# Altium project STM32F405RGT6核心板.PrjPcb
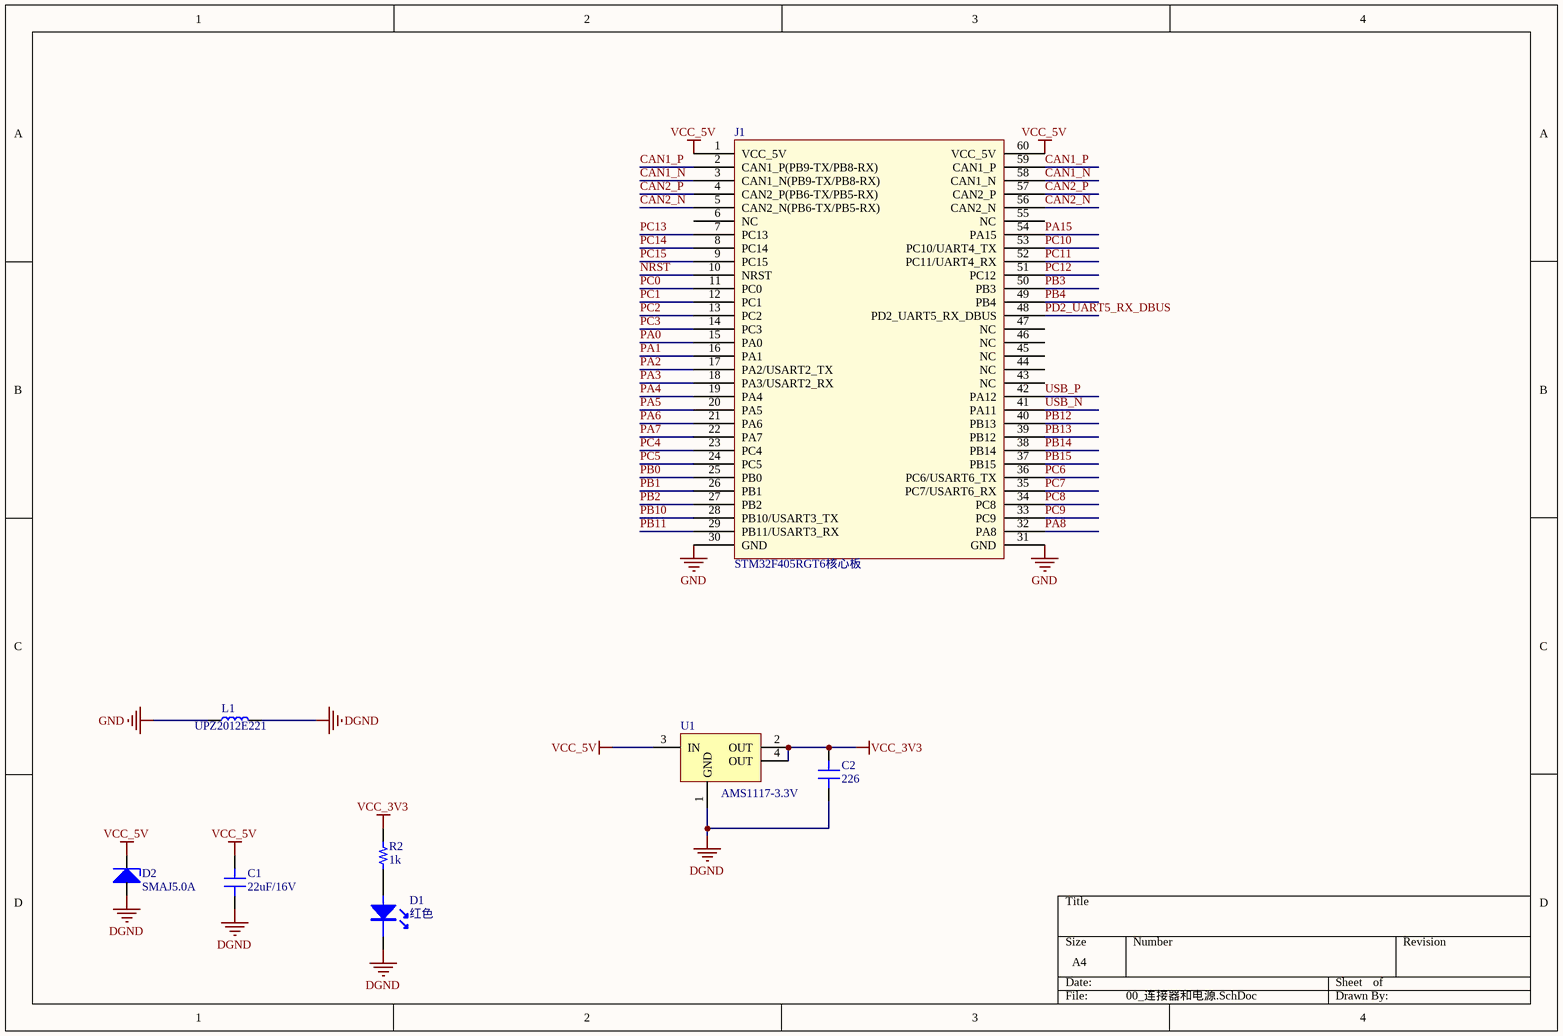
[diagram p0: 00_连接器和电源.SchDoc]
3 sheets, 36 parts. Net scope: global (net labels, ports and power ports of the same name join across sheets).
Board file: STM32F405RGT6核心板.PcbDoc
Sheets:
  00_连接器和电源.SchDoc
  01_STM32F4最小系统.SchDoc
  02_其它.SchDoc

## Sheet 00_连接器和电源.SchDoc
size A4

### Parts
C1  22uF/16V  [C1206/3216]
C2  226  [C0603/1608]
D1  Color: 红色  [LED0603-红色]  (hidden comment: LED-红色)
D2  SMAJ5.0A  [DO-214AC/SMA]
J1  STM32F405RGT6核心板  [3710M060037G0FR01]
L1  UPZ2012E221  [L0805/2012]
R2  1k  [R0603/1608]
U1  AMS1117-3.3V  [SOT-223]

### Nets
DGND: C1.1 C2.1 D1.2(K) D2.1(+) L1.2 U1.1(GND)
GND: J1.30(GND) J1.31(GND) L1.1
VCC_3V3: C2.2 R2.2 U1.2(OUT) U1.4(OUT)
VCC_5V: C1.2 D2.2(-) J1.1(VCC_5V) J1.60(VCC_5V) U1.3(IN)
CAN1_N: J1.3(CAN1_N(PB9-TX/PB8-RX)) J1.58(CAN1_N)
CAN1_P: J1.2(CAN1_P(PB9-TX/PB8-RX)) J1.59(CAN1_P)
CAN2_N: J1.5(CAN2_N(PB6-TX/PB5-RX)) J1.56(CAN2_N)
CAN2_P: J1.4(CAN2_P(PB6-TX/PB5-RX)) J1.57(CAN2_P)
NRST: J1.10(NRST)
PA0: J1.15(PA0)
PA1: J1.16(PA1)
PA2: J1.17(PA2/USART2_TX)
PA3: J1.18(PA3/USART2_RX)
PA4: J1.19(PA4)
PA5: J1.20(PA5)
PA6: J1.21(PA6)
PA7: J1.22(PA7)
PA8: J1.32(PA8)
PA15: J1.54(PA15)
PB0: J1.25(PB0)
PB1: J1.26(PB1)
PB2: J1.27(PB2)
PB3: J1.50(PB3)
PB4: J1.49(PB4)
PB10: J1.28(PB10/USART3_TX)
PB11: J1.29(PB11/USART3_RX)
PB12: J1.40(PB13)
PB13: J1.39(PB12)
PB14: J1.38(PB14)
PB15: J1.37(PB15)
PC0: J1.11(PC0)
PC1: J1.12(PC1)
PC2: J1.13(PC2)
PC3: J1.14(PC3)
PC4: J1.23(PC4)
PC5: J1.24(PC5)
PC6: J1.36(PC6/USART6_TX)
PC7: J1.35(PC7/USART6_RX)
PC8: J1.34(PC8)
PC9: J1.33(PC9)
PC10: J1.53(PC10/UART4_TX)
PC11: J1.52(PC11/UART4_RX)
PC12: J1.51(PC12)
PC13: J1.7(PC13)
PC14: J1.8(PC14)
PC15: J1.9(PC15)
PD2_UART5_RX_DBUS: J1.48(PD2_UART5_RX_DBUS)
USB_N: J1.41(PA11)
USB_P: J1.42(PA12)
NetD1_1: D1.1(A) R2.1

Not connected (* = marked no-connect by the designer): J1 6(NC) 43(NC) 44(NC) 45(NC) 46(NC) 47(NC) 55(NC)

### Library data of the parts
C1 C2 = 陶瓷电容
D1 = LED: 发光二极管
D2 = 瞬态抑制二极管
J1 = STM32F405RGT6核心板: 3710(F/M)060037G0FR01
L1 = 磁珠: 贴片磁珠
R2 = 电阻
U1 = AMS1117: AMS1117低压差线性稳压器

## Sheet 01_STM32F4最小系统.SchDoc
size A4
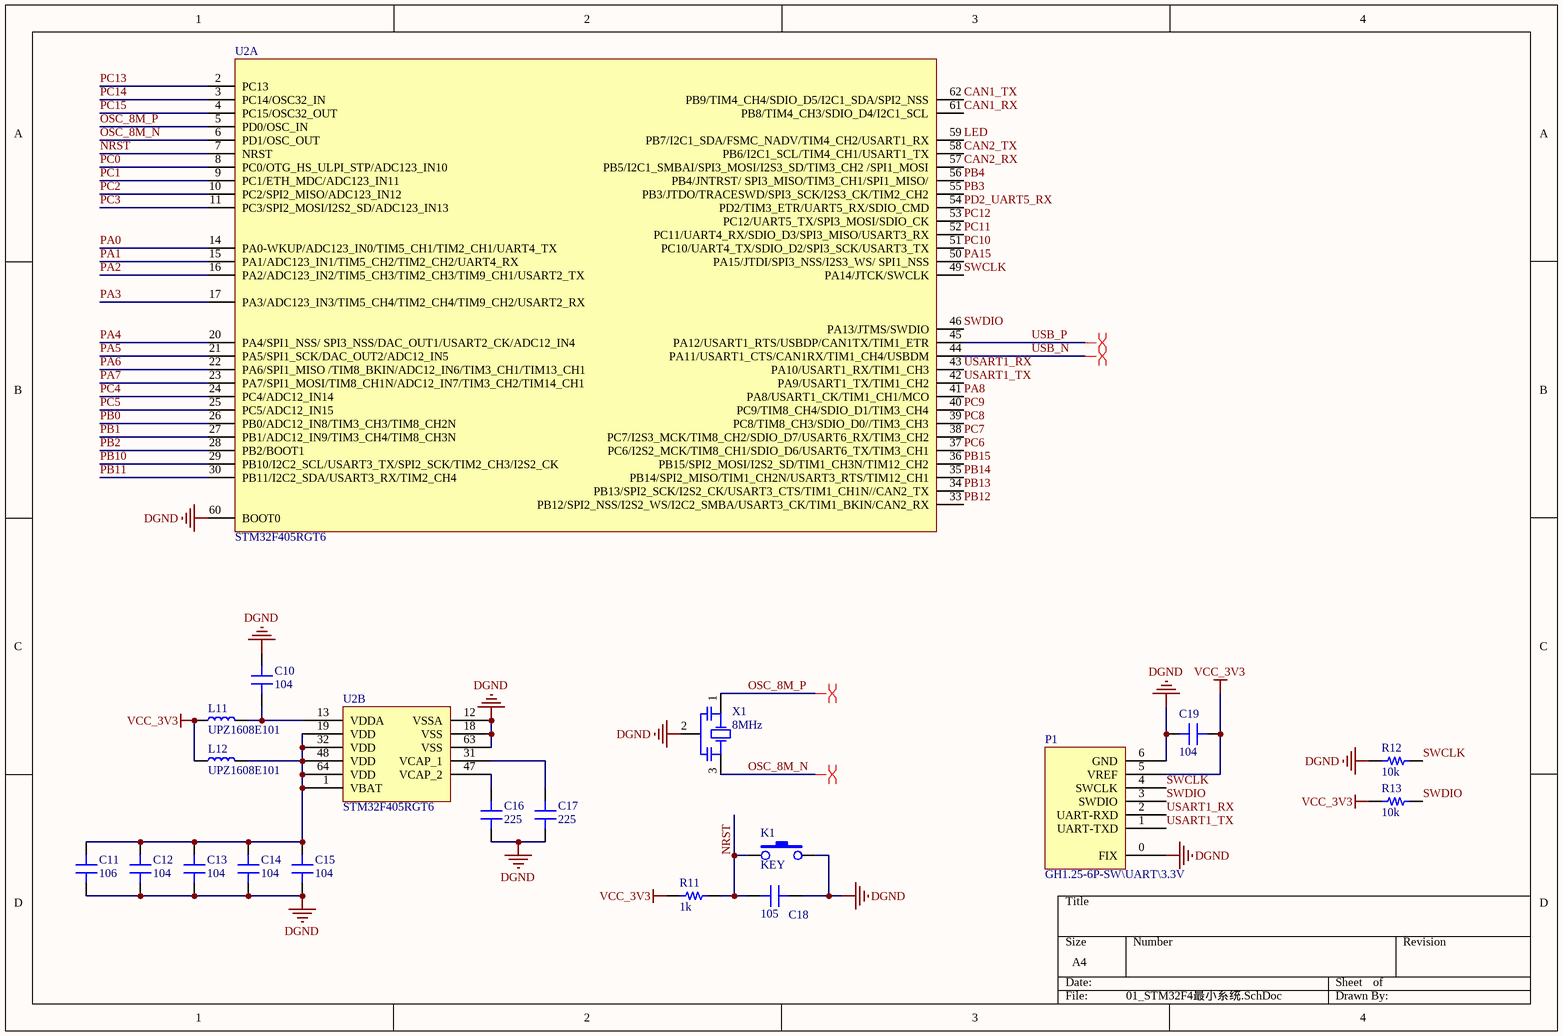
[diagram p1: 01_STM32F4最小系统.SchDoc]

### Parts
C10  104  [C0603/1608]
C11  106  [C0603/1608]
C12  104  [C0603/1608]
C13  104  [C0603/1608]
C14  104  [C0603/1608]
C15  104  [C0603/1608]
C16  225  [C0603/1608]
C17  225  [C0603/1608]
C18  105  [C0603/1608]
C19  104  [C0603/1608]
K1  KEY  [按键（2脚）]
L11  UPZ1608E101  [L0603/1608]
L12  UPZ1608E101  [L0603/1608]
P1  GH1.25-6P-SW\UART\3.3V  [GH1.25-6P（卧贴）]
R11  1k  [R0603/1608]
R12  10k  [R0603/1608]
R13  10k  [R0603/1608]
U2  STM32F405RGT6  [LQFP64]  (parts A,B of 2)
X1  8MHz  [XTAL-3213]

### Nets
DGND: C10.2 C11.1 C12.1 C13.1 C14.1 C15.1 C16.1 C17.1 C18.1 C19.2 K1.2 P1.0(FIX) P1.6(GND) R12.1 U2.12(VSSA) U2.18(VSS) U2.60(BOOT0) U2.63(VSS) X1.2(OSC2)
VCC_3V3: C19.1 L11.1 L12.1 P1.5(VREF) R11.1 R13.1
CAN1_RX: U2.61(PB8/TIM4_CH3/SDIO_D4/I2C1_SCL)
CAN1_TX: U2.62(PB9/TIM4_CH4/SDIO_D5/I2C1_SDA/SPI2_NSS)
CAN2_RX: U2.57(PB5/I2C1_SMBAI/SPI3_MOSI/I2S3_SD/TIM3_CH2_/SPI1_MOSI)
CAN2_TX: U2.58(PB6/I2C1_SCL/TIM4_CH1/USART1_TX)
LED: U2.59(PB7/I2C1_SDA/FSMC_NADV/TIM4_CH2/USART1_RX)
NRST: C18.2 K1.1 R11.2 U2.7(NRST)
OSC_8M_N: U2.6(PD1/OSC_OUT) X1.3(OSC3)
OSC_8M_P: U2.5(PD0/OSC_IN) X1.1(OSC1)
PA0: U2.14(PA0-WKUP/ADC123_IN0/TIM5_CH1/TIM2_CH1/UART4_TX)
PA1: U2.15(PA1/ADC123_IN1/TIM5_CH2/TIM2_CH2/UART4_RX)
PA2: U2.16(PA2/ADC123_IN2/TIM5_CH3/TIM2_CH3/TIM9_CH1/USART2_TX)
PA3: U2.17(PA3/ADC123_IN3/TIM5_CH4/TIM2_CH4/TIM9_CH2/USART2_RX)
PA4: U2.20(PA4/SPI1_NSS/_SPI3_NSS/DAC_OUT1/USART2_CK/ADC12_IN4)
PA5: U2.21(PA5/SPI1_SCK/DAC_OUT2/ADC12_IN5)
PA6: U2.22(PA6/SPI1_MISO_/TIM8_BKIN/ADC12_IN6/TIM3_CH1/TIM13_CH1)
PA7: U2.23(PA7/SPI1_MOSI/TIM8_CH1N/ADC12_IN7/TIM3_CH2/TIM14_CH1)
PA8: U2.41(PA8/USART1_CK/TIM1_CH1/MCO)
PA15: U2.50(PA15/JTDI/SPI3_NSS/I2S3_WS/_SPI1_NSS)
PB0: U2.26(PB0/ADC12_IN8/TIM3_CH3/TIM8_CH2N)
PB1: U2.27(PB1/ADC12_IN9/TIM3_CH4/TIM8_CH3N)
PB2: U2.28(PB2/BOOT1)
PB3: U2.55(PB3/JTDO/TRACESWD/SPI3_SCK/I2S3_CK/TIM2_CH2)
PB4: U2.56(PB4/JNTRST/_SPI3_MISO/TIM3_CH1/SPI1_MISO/)
PB10: U2.29(PB10/I2C2_SCL/USART3_TX/SPI2_SCK/TIM2_CH3/I2S2_CK)
PB11: U2.30(PB11/I2C2_SDA/USART3_RX/TIM2_CH4)
PB12: U2.33(PB12/SPI2_NSS/I2S2_WS/I2C2_SMBA/USART3_CK/TIM1_BKIN/CAN2_RX)
PB13: U2.34(PB13/SPI2_SCK/I2S2_CK/USART3_CTS/TIM1_CH1N//CAN2_TX)
PB14: U2.35(PB14/SPI2_MISO/TIM1_CH2N/USART3_RTS/TIM12_CH1)
PB15: U2.36(PB15/SPI2_MOSI/I2S2_SD/TIM1_CH3N/TIM12_CH2)
PC0: U2.8(PC0/OTG_HS_ULPI_STP/ADC123_IN10)
PC1: U2.9(PC1/ETH_MDC/ADC123_IN11)
PC2: U2.10(PC2/SPI2_MISO/ADC123_IN12)
PC3: U2.11(PC3/SPI2_MOSI/I2S2_SD/ADC123_IN13)
PC4: U2.24(PC4/ADC12_IN14)
PC5: U2.25(PC5/ADC12_IN15)
PC6: U2.37(PC6/I2S2_MCK/TIM8_CH1/SDIO_D6/USART6_TX/TIM3_CH1)
PC7: U2.38(PC7/I2S3_MCK/TIM8_CH2/SDIO_D7/USART6_RX/TIM3_CH2)
PC8: U2.39(PC8/TIM8_CH3/SDIO_D0//TIM3_CH3)
PC9: U2.40(PC9/TIM8_CH4/SDIO_D1/TIM3_CH4)
PC10: U2.51(PC10/UART4_TX/SDIO_D2/SPI3_SCK/USART3_TX)
PC11: U2.52(PC11/UART4_RX/SDIO_D3/SPI3_MISO/USART3_RX)
PC12: U2.53(PC12/UART5_TX/SPI3_MOSI/SDIO_CK)
PC13: U2.2(PC13)
PC14: U2.3(PC14/OSC32_IN)
PC15: U2.4(PC15/OSC32_OUT)
PD2_UART5_RX: U2.54(PD2/TIM3_ETR/UART5_RX/SDIO_CMD)
SWCLK: P1.4(SWCLK) R12.2 U2.49(PA14/JTCK/SWCLK)
SWDIO: P1.3(SWDIO) R13.2 U2.46(PA13/JTMS/SWDIO)
USART1_RX: P1.2(UART-RXD) U2.43(PA10/USART1_RX/TIM1_CH3)
USART1_TX: P1.1(UART-TXD) U2.42(PA9/USART1_TX/TIM1_CH2)
USB_N: U2.44(PA11/USART1_CTS/CAN1RX/TIM1_CH4/USBDM)
USB_P: U2.45(PA12/USART1_RTS/USBDP/CAN1TX/TIM1_ETR)
NetC10_1: C10.1 L11.2 U2.13(VDDA)
NetC11_2: C11.2 C12.2 C13.2 C14.2 C15.2 L12.2 U2.1(VBAT) U2.19(VDD) U2.32(VDD) U2.48(VDD) U2.64(VDD)
NetC16_2: C16.2 U2.47(VCAP_2)
NetC17_2: C17.2 U2.31(VCAP_1)

### Layout directives
differential pair: OSC_8M_N, OSC_8M_P, USB_N, USB_P

### Library data of the parts
C10-C19 = 陶瓷电容
K1 = 按键（2脚）: 按键-2脚贴片
L11 L12 = 磁珠: 贴片磁珠
R11-R13 = 电阻
U2 = STM32F405RGT6: 微控制器STM32F405RGT6
X1 = 晶振（带起振电容）: 晶振

## Sheet 02_其它.SchDoc
size A4
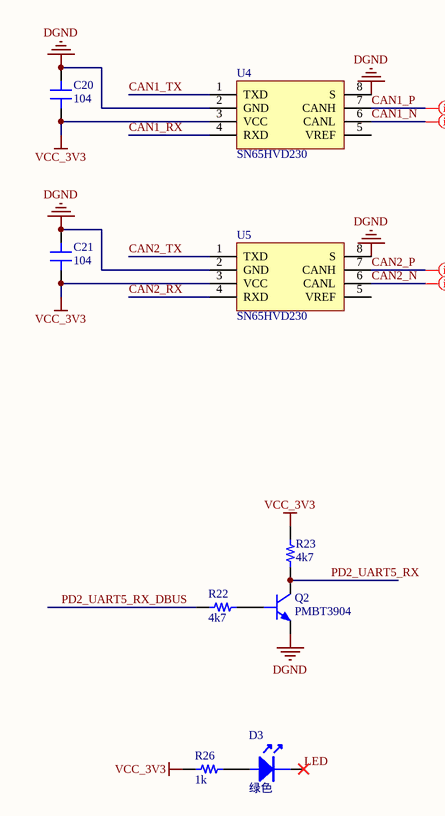
[diagram p2: 02_其它.SchDoc]

### Parts
C20  104  [C0603/1608]
C21  104  [C0603/1608]
D3  Color: 绿色  [LED0603-绿色]  (hidden comment: LED-绿色)
Q2  PMBT3904  [SOT-23-3]
R22  4k7  [R0603/1608]
R23  4k7  [R0603/1608]
R26  1k  [R0603/1608]
U4  SN65HVD230  [SOP-8]
U5  SN65HVD230  [SOP-8]

### Nets
DGND: C20.2 C21.2 Q2.2(E) U4.2(GND) U4.8(S) U5.2(GND) U5.8(S)
VCC_3V3: C20.1 C21.1 R23.1 R26.2 U4.3(VCC) U5.3(VCC)
CAN1_N: U4.6(CANL)
CAN1_P: U4.7(CANH)
CAN1_RX: U4.4(RXD)
CAN1_TX: U4.1(TXD)
CAN2_N: U5.6(CANL)
CAN2_P: U5.7(CANH)
CAN2_RX: U5.4(RXD)
CAN2_TX: U5.1(TXD)
LED: D3.2(K)
PD2_UART5_RX: Q2.3(C) R23.2
PD2_UART5_RX_DBUS: R22.2
NetD3_1: D3.1(A) R26.1
NetQ2_1: Q2.1(B) R22.1

Not connected (* = marked no-connect by the designer): U4 5(VREF); U5 5(VREF)

### Layout directives
differential pair: CAN1_N, CAN1_P, CAN2_N, CAN2_P

### Library data of the parts
C20 C21 = 陶瓷电容
D3 = LED: 发光二极管
Q2 = NPN: NPN三极管; Published: 8-Jun-2000; LatestRevisionDate: 29-May-2009; LatestRevisionNote: IPC-7351 Footprint Added.; PackageVersion: Aug-1999; PackageReference: SOT-23B; Publisher: Altium Limited; PackageDescription: 3-Pin SOT-23 Package 0.95 mm Pitch, 2.4 mm Lead Span
R22 R23 R26 = 电阻
U4 U5 = SN65HVD230: CAN收发芯片

## Nets that join several sheets
DGND: 00_连接器和电源 (6 pins), 01_STM32F4最小系统 (19 pins), 02_其它 (7 pins)
VCC_3V3: 00_连接器和电源 (C2.2 R2.2 U1.2 U1.4), 01_STM32F4最小系统 (6 pins), 02_其它 (6 pins)
CAN1_N: 00_连接器和电源 (J1.3 J1.58), 02_其它 (U4.6)
CAN1_P: 00_连接器和电源 (J1.2 J1.59), 02_其它 (U4.7)
CAN1_RX: 01_STM32F4最小系统 (U2.61), 02_其它 (U4.4)
CAN1_TX: 01_STM32F4最小系统 (U2.62), 02_其它 (U4.1)
CAN2_N: 00_连接器和电源 (J1.5 J1.56), 02_其它 (U5.6)
CAN2_P: 00_连接器和电源 (J1.4 J1.57), 02_其它 (U5.7)
CAN2_RX: 01_STM32F4最小系统 (U2.57), 02_其它 (U5.4)
CAN2_TX: 01_STM32F4最小系统 (U2.58), 02_其它 (U5.1)
LED: 01_STM32F4最小系统 (U2.59), 02_其它 (D3.2)
NRST: 00_连接器和电源 (J1.10), 01_STM32F4最小系统 (C18.2 K1.1 R11.2 U2.7)
PA0: 00_连接器和电源 (J1.15), 01_STM32F4最小系统 (U2.14)
PA1: 00_连接器和电源 (J1.16), 01_STM32F4最小系统 (U2.15)
PA2: 00_连接器和电源 (J1.17), 01_STM32F4最小系统 (U2.16)
PA3: 00_连接器和电源 (J1.18), 01_STM32F4最小系统 (U2.17)
PA4: 00_连接器和电源 (J1.19), 01_STM32F4最小系统 (U2.20)
PA5: 00_连接器和电源 (J1.20), 01_STM32F4最小系统 (U2.21)
PA6: 00_连接器和电源 (J1.21), 01_STM32F4最小系统 (U2.22)
PA7: 00_连接器和电源 (J1.22), 01_STM32F4最小系统 (U2.23)
PA8: 00_连接器和电源 (J1.32), 01_STM32F4最小系统 (U2.41)
PA15: 00_连接器和电源 (J1.54), 01_STM32F4最小系统 (U2.50)
PB0: 00_连接器和电源 (J1.25), 01_STM32F4最小系统 (U2.26)
PB1: 00_连接器和电源 (J1.26), 01_STM32F4最小系统 (U2.27)
PB2: 00_连接器和电源 (J1.27), 01_STM32F4最小系统 (U2.28)
PB3: 00_连接器和电源 (J1.50), 01_STM32F4最小系统 (U2.55)
PB4: 00_连接器和电源 (J1.49), 01_STM32F4最小系统 (U2.56)
PB10: 00_连接器和电源 (J1.28), 01_STM32F4最小系统 (U2.29)
PB11: 00_连接器和电源 (J1.29), 01_STM32F4最小系统 (U2.30)
PB12: 00_连接器和电源 (J1.40), 01_STM32F4最小系统 (U2.33)
PB13: 00_连接器和电源 (J1.39), 01_STM32F4最小系统 (U2.34)
PB14: 00_连接器和电源 (J1.38), 01_STM32F4最小系统 (U2.35)
PB15: 00_连接器和电源 (J1.37), 01_STM32F4最小系统 (U2.36)
PC0: 00_连接器和电源 (J1.11), 01_STM32F4最小系统 (U2.8)
PC1: 00_连接器和电源 (J1.12), 01_STM32F4最小系统 (U2.9)
PC2: 00_连接器和电源 (J1.13), 01_STM32F4最小系统 (U2.10)
PC3: 00_连接器和电源 (J1.14), 01_STM32F4最小系统 (U2.11)
PC4: 00_连接器和电源 (J1.23), 01_STM32F4最小系统 (U2.24)
PC5: 00_连接器和电源 (J1.24), 01_STM32F4最小系统 (U2.25)
PC6: 00_连接器和电源 (J1.36), 01_STM32F4最小系统 (U2.37)
PC7: 00_连接器和电源 (J1.35), 01_STM32F4最小系统 (U2.38)
PC8: 00_连接器和电源 (J1.34), 01_STM32F4最小系统 (U2.39)
PC9: 00_连接器和电源 (J1.33), 01_STM32F4最小系统 (U2.40)
PC10: 00_连接器和电源 (J1.53), 01_STM32F4最小系统 (U2.51)
PC11: 00_连接器和电源 (J1.52), 01_STM32F4最小系统 (U2.52)
PC12: 00_连接器和电源 (J1.51), 01_STM32F4最小系统 (U2.53)
PC13: 00_连接器和电源 (J1.7), 01_STM32F4最小系统 (U2.2)
PC14: 00_连接器和电源 (J1.8), 01_STM32F4最小系统 (U2.3)
PC15: 00_连接器和电源 (J1.9), 01_STM32F4最小系统 (U2.4)
PD2_UART5_RX: 01_STM32F4最小系统 (U2.54), 02_其它 (Q2.3 R23.2)
PD2_UART5_RX_DBUS: 00_连接器和电源 (J1.48), 02_其它 (R22.2)
USB_N: 00_连接器和电源 (J1.41), 01_STM32F4最小系统 (U2.44)
USB_P: 00_连接器和电源 (J1.42), 01_STM32F4最小系统 (U2.45)